# Altium schematic sheet GPIO_HDR2X10.SchDoc
size A3
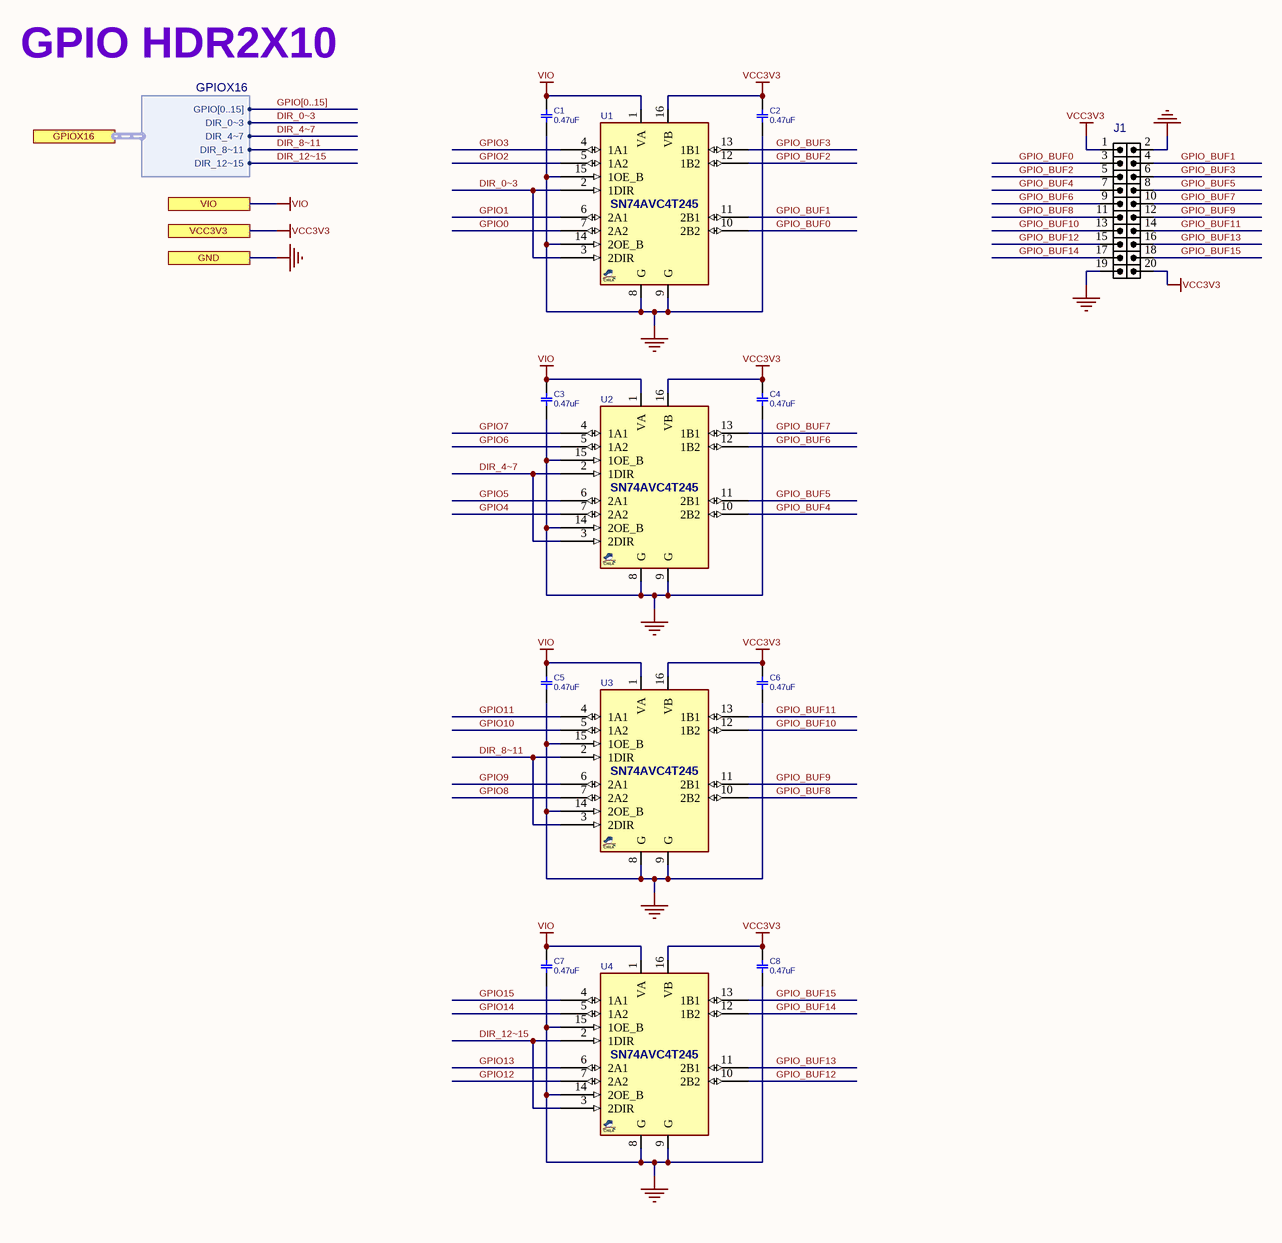
[diagram p0: GPIO_HDR2X10.SchDoc]

## Parts
C1  0.47uF  [C0402]
C2  0.47uF  [C0402]
C3  0.47uF  [C0402]
C4  0.47uF  [C0402]
C5  0.47uF  [C0402]
C6  0.47uF  [C0402]
C7  0.47uF  [C0402]
C8  0.47uF  [C0402]
J1  HDRM_2X10  [IDC_2X10]  (value not drawn)
U1  SN74AVC4T245  [SOG65_16]  (value not drawn)
U2  SN74AVC4T245  [SOG65_16]  (value not drawn)
U3  SN74AVC4T245  [SOG65_16]  (value not drawn)
U4  SN74AVC4T245  [SOG65_16]  (value not drawn)

## Ports
GND, GPIOX16 (harness GPIOX16), VCC3V3, VIO

## Harnesses
GPIOX16: DIR_4~7, DIR_8~11, GPIO[0..15], DIR_0~3, DIR_12~15

## Nets
GND: C1.1 C2.1 C3.1 C4.1 C5.1 C6.1 C7.1 C8.1 J1.2 J1.19 U1.8(G) U1.9(G) U1.14(2OE_B) U1.15(1OE_B) U2.8(G) U2.9(G) U2.14(2OE_B) U2.15(1OE_B) U3.8(G) U3.9(G) U3.14(2OE_B) U3.15(1OE_B) U4.8(G) U4.9(G) U4.14(2OE_B) U4.15(1OE_B) ; port GND
VCC3V3: C2.2 C4.2 C6.2 C8.2 J1.1 J1.20 U1.16(VB) U2.16(VB) U3.16(VB) U4.16(VB) ; port VCC3V3
VIO: C1.2 C3.2 C5.2 C7.2 U1.1(VA) U2.1(VA) U3.1(VA) U4.1(VA) ; port VIO
DIR_0~3: U1.2(1DIR) U1.3(2DIR) ; port GPIOX16.DIR_0~3
DIR_4~7: U2.2(1DIR) U2.3(2DIR) ; port GPIOX16.DIR_4~7
DIR_8~11: U3.2(1DIR) U3.3(2DIR) ; port GPIOX16.DIR_8~11
DIR_12~15: U4.2(1DIR) U4.3(2DIR) ; port GPIOX16.DIR_12~15
GPIO0: U1.7(2A2)
GPIO1: U1.6(2A1)
GPIO2: U1.5(1A2)
GPIO3: U1.4(1A1)
GPIO4: U2.7(2A2)
GPIO5: U2.6(2A1)
GPIO6: U2.5(1A2)
GPIO7: U2.4(1A1)
GPIO8: U3.7(2A2)
GPIO9: U3.6(2A1)
GPIO10: U3.5(1A2)
GPIO11: U3.4(1A1)
GPIO12: U4.7(2A2)
GPIO13: U4.6(2A1)
GPIO14: U4.5(1A2)
GPIO15: U4.4(1A1)
GPIO_BUF0: J1.3 U1.10(2B2)
GPIO_BUF1: J1.4 U1.11(2B1)
GPIO_BUF2: J1.5 U1.12(1B2)
GPIO_BUF3: J1.6 U1.13(1B1)
GPIO_BUF4: J1.7 U2.10(2B2)
GPIO_BUF5: J1.8 U2.11(2B1)
GPIO_BUF6: J1.9 U2.12(1B2)
GPIO_BUF7: J1.10 U2.13(1B1)
GPIO_BUF8: J1.11 U3.10(2B2)
GPIO_BUF9: J1.12 U3.11(2B1)
GPIO_BUF10: J1.13 U3.12(1B2)
GPIO_BUF11: J1.14 U3.13(1B1)
GPIO_BUF12: J1.15 U4.10(2B2)
GPIO_BUF13: J1.16 U4.11(2B1)
GPIO_BUF14: J1.17 U4.12(1B2)
GPIO_BUF15: J1.18 U4.13(1B1)

## Buses and harness runs
bus GPIO[0..15]

## Notes on the sheet
- GPIO HDR2X10
- Title
- Size:
- Date:
- A3
- Number:
- Time:
- Revision:
- Sheet
- of
- File:

## Library data of the parts
C1-C8 = CAP_SMD_MLCC_100n50TDK: CAP, MLCC, 100nF, 50V, X7R, 10%, 0402C; PARAM: X7R, 10%, -55~125oC; MANF_P#: GCM155R71H104KE02D; MANF: Murata; PARAM2: 50V; ASSEMBLY: ASSEMBLY; PRICE: 100= 4$; VALUE: 0.47uF
J1 = HDR_M_2X10: CONN, HEADER, Male, pitch: 2.54mm, 20POS; VALUE: HDRM_2X10
U1-U4 = SN74AVC4T245_TSSOP16: Level Translator, Quad, 3State; MANF: TEXAS INSTRUMENTS; MANF_P#: SN74AVC4T245PWR; PARAM2: 1.2~3.6V; PARAM: 2.9ns; PRICE: 1$; VALUE: SN74AVC4T245